# EAGLE design finalizeScale (EAGLE 7.3.0)
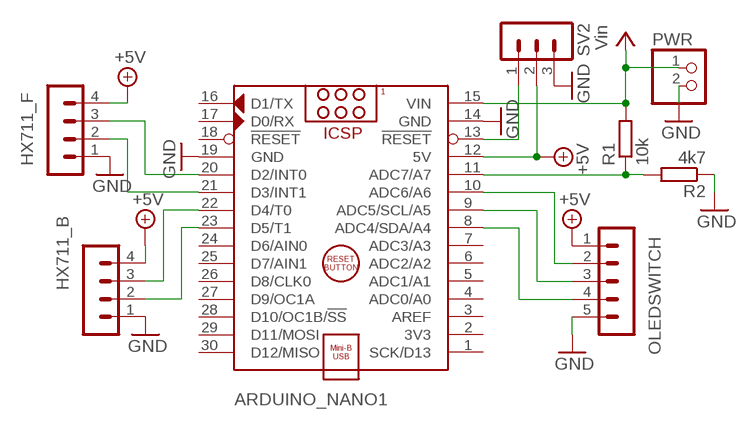
[diagram p0: schematic, sheet 1]

## Parts
ARDUINO_NANO1  ARDUINO_NANO  [ARDUINO_NANO]
HX711_B  MA04-1  [MA04-1]
HX711_F  MA04-1  [MA04-1]
OLEDSWITCH  MA05-1  [MA05-1]
PWR  PINHD-1X2  [1X02]
R1  10k  R-EU_0207/10  [0207/10]
R2  4k7  R-EU_0207/10  [0207/10]
SV2  MA03-1  [MA03-1]

## Nets
+5V: ARDUINO_NANO1.12(5V) HX711_B.4 HX711_F.4 OLEDSWITCH.1 SV2.2
GND: ARDUINO_NANO1.14(GND) ARDUINO_NANO1.19(GND) HX711_B.1 HX711_F.1 OLEDSWITCH.5 PWR.2 R2.1 SV2.3
N$2: ARDUINO_NANO1.8(ADC4/SDA/A4) OLEDSWITCH.4
N$3: ARDUINO_NANO1.9(ADC5/SCL/A5) OLEDSWITCH.3
N$4: ARDUINO_NANO1.11(ADC7/A7) R1.1 R2.2
N$5: ARDUINO_NANO1.21(D3/INT1) HX711_F.2
N$9: ARDUINO_NANO1.10(ADC6/A6) OLEDSWITCH.2
N$10: ARDUINO_NANO1.22(D4/T0) HX711_B.3
N$11: ARDUINO_NANO1.23(D5/T1) HX711_B.2
N$12: ARDUINO_NANO1.20(D2/INT0) HX711_F.3
N$14: ARDUINO_NANO1.13(!RESET) SV2.1
VCC: ARDUINO_NANO1.15(VIN) PWR.1 R1.2 ; supply symbol labelled Vin
Unconnected: ARDUINO_NANO1.1(SCK/D13) ARDUINO_NANO1.2(3V3) ARDUINO_NANO1.3(AREF) ARDUINO_NANO1.4(ADC0/A0) ARDUINO_NANO1.5(ADC1/A1) ARDUINO_NANO1.6(ADC2/A2) ARDUINO_NANO1.7(ADC3/A3) ARDUINO_NANO1.16(D1/TX) ARDUINO_NANO1.17(D0/RX) ARDUINO_NANO1.18(!RESET) ARDUINO_NANO1.24(D6/AIN0) ARDUINO_NANO1.25(D7/AIN1) ARDUINO_NANO1.26(D8/CLK0) ARDUINO_NANO1.27(D9/OC1A) ARDUINO_NANO1.28(D10/OC1B/!SS) ARDUINO_NANO1.29(D11/MOSI) ARDUINO_NANO1.30(D12/MISO)

## Library data of the parts
ARDUINO_NANO1 = ArduinoNanoV30:ARDUINO_NANO: Arduino Nano V3.0 Module Overview: The Arduino Nano is a small, complete, and breadboard-friendly board based on the ATmega328 (Arduino Nano 3.x) or ATmega168 (Arduino Nano 2.x). It has more or less the same functionality of the Arduino Duemilanove, but in a different package. It lacks only a DC power jack, and works with a Mini-B USB cable instead of a standard one. The Nano was designed and is being produced by Gravitech <http://www.gravitech.us/arna30wiatp.html>. General specifications: Item Value Microcontroller Atmel ATmega168 or ATmega328 Operating Voltage (logic level) 5 V Input Voltage (recommended) 7-12 V Input Voltage (limits) 6-20 V Digital I/O Pins 14 (of which 6 provide PWM output) Analog Input Pins 8 DC Current per I/O Pin 40 mA Flash Memory 16 KB (ATmega168) or 32 KB (ATmega328) of which 2 KB used by bootloader SRAM 1 KB (ATmega168) or 2 KB (ATmega328) EEPROM 512 bytes (ATmega168) or 1 KB (ATmega328) Clock Speed 16 MHz Dimensions (Inches) 0.73" x 1.70" Dimensions (mm) 18mm x 45mm Overall height About 9 mm (not including pins) Weigth 5 g Power: The Arduino Nano can be powered via the Mini-B USB connection, 6-20V unregulated external power supply (pin 30), or 5V regulated external power supply (pin 27). The power source is automatically selected to the highest voltage source. Memory: The ATmega168 has 16 KB of flash memory for storing code (of which 2 KB is used for the bootloader); the ATmega328 has 32 KB, (also with 2 KB used for the bootloader). The ATmega168 has 1 KB of SRAM and 512 bytes of EEPROM (which can be read and written with the EEPROM library); the ATmega328 has 2 KB of SRAM and 1 KB of EEPROM. Input and Output: Each of the 14 digital pins on the Nano can be used as an input or output, using pinMode(), digitalWrite(), and digitalRead() functions. They operate at 5 volts. Each pin can provide or receive a maximum of 40 mA and has an internal pull-up resistor (disconnected by default) of 20-50 kOhms. In addition, some pins have specialized functions. Visit Arduino - ArduinoBoardNano <https://www.arduino.cc/en/Main/ArduinoBoardNano>
HX711_B HX711_F = con-lstb:MA04-1: PIN HEADER; OC_FARNELL: unknown; OC_NEWARK: unknown
OLEDSWITCH = con-lstb:MA05-1: PIN HEADER; OC_FARNELL: unknown; OC_NEWARK: unknown
PWR = pinhead:PINHD-1X2: PIN HEADER
R1 R2 = rcl:R-EU_: RESISTOR, European symbol
SV2 = con-lstb:MA03-1: PIN HEADER; OC_FARNELL: unknown; OC_NEWARK: unknown

## Net classes
0 default: width 0.076 mm, drill 0.025 mm, clearance 0.013 mm

## Board
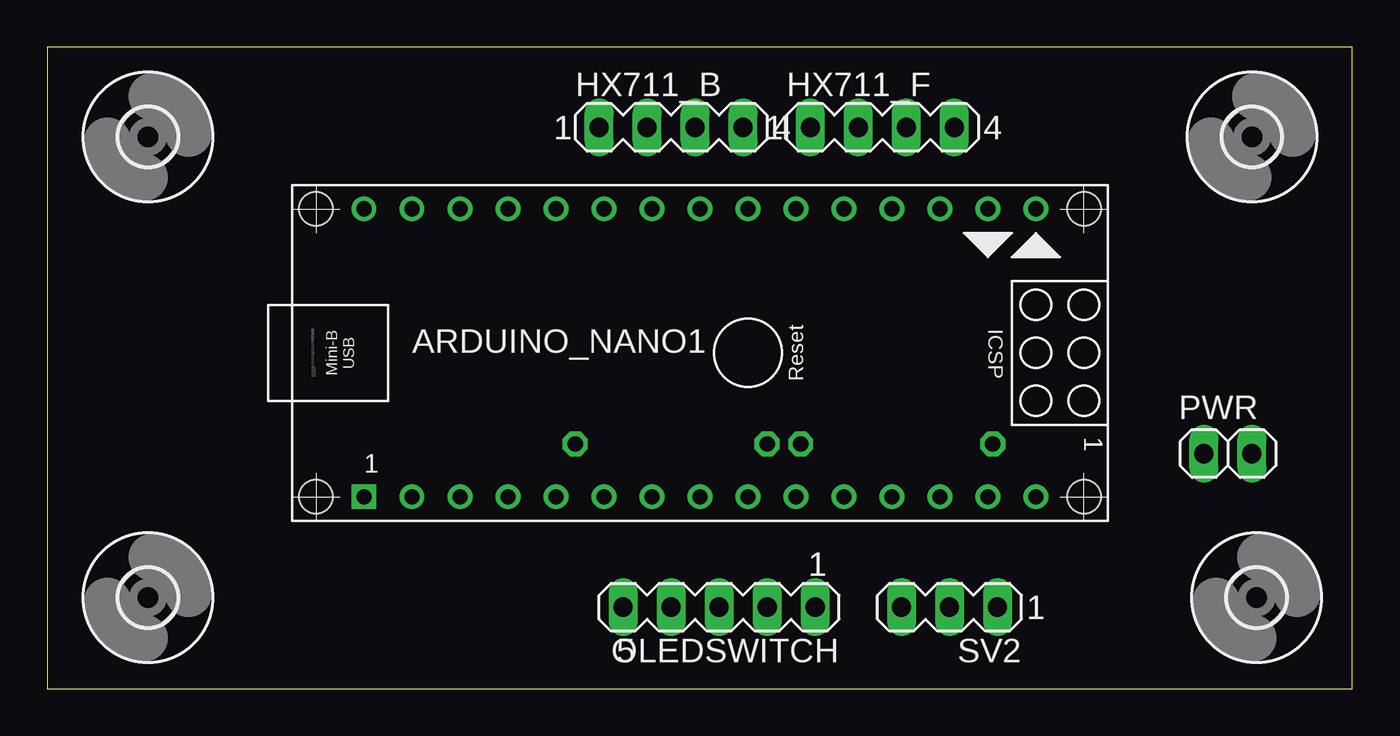
[diagram p1: board, top side]
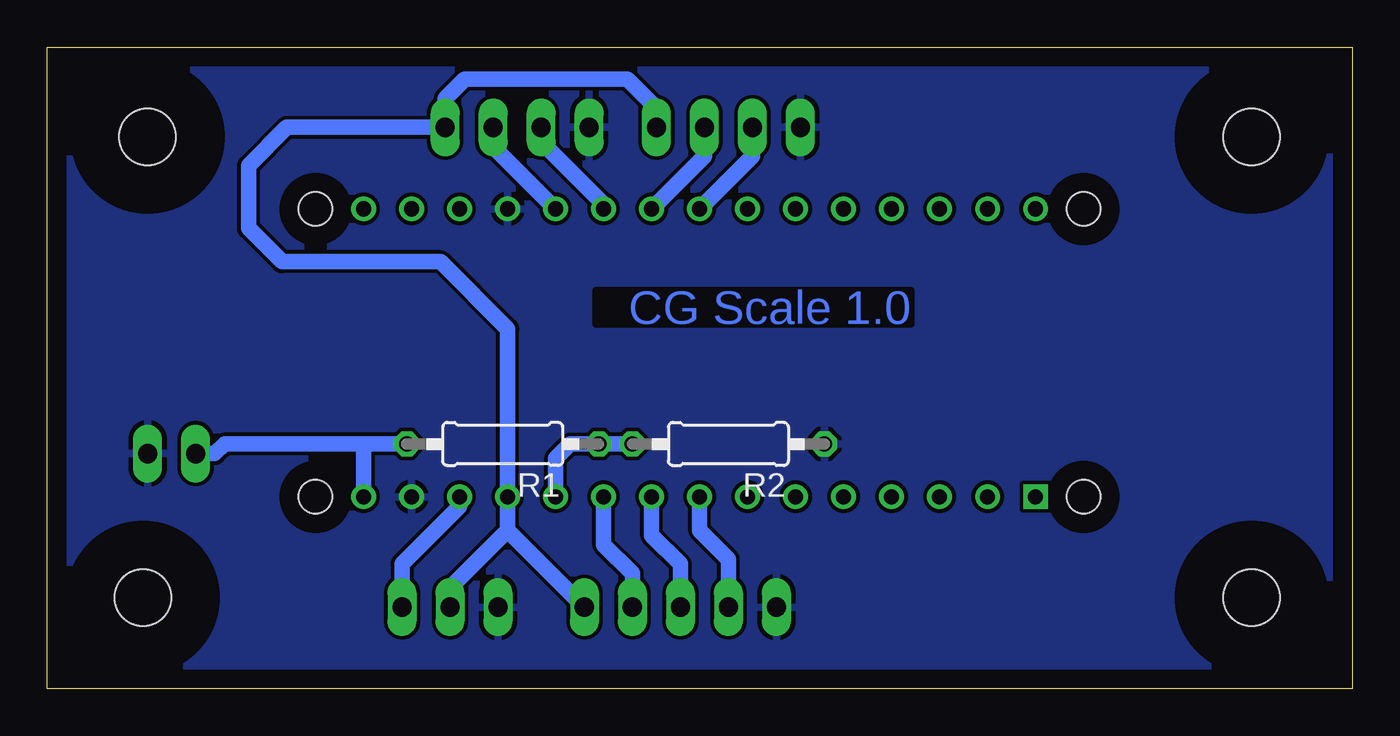
[diagram p2: board, bottom side, seen from below]

Size 69.07 x 33.96 mm. Coordinates in mm from the lower left corner, seen from the top.
Outline: 0,0 69.07,0 69.07,33.96 0,33.96 0,0
Copper layers (1*16): Top 0.035mm / dielectric 1.5mm / Bottom 0.035mm
Design rules "default": minimum track width 10mil, minimum drill 24mil, track to track 8mil, track to pad 8mil, pad to pad 8mil, via to via 8mil, smd to smd 8mil, copper to edge 40mil, drill to drill 8mil, minimum pad ring 10mil, minimum via ring 8mil, stop-mask expansion 4mil, vias tented up to drill 0mil, thermal gap 10mil

### Footprints (pad centres in the part's own frame; a part is rotated, then mirrored left to right if it is on the bottom)
ARDUINO_NANO = drill 0.8 square: 1 -20.32,-7.62 | drill 0.8: 2 -17.78,-7.62; 3 -15.24,-7.62; 4 -12.7,-7.62; 5 -10.16,-7.62; 6 -7.62,-7.62; 7 -5.08,-7.62; 8 -2.54,-7.62; 9 0,-7.62; 10 2.54,-7.62; 11 5.08,-7.62; 12 7.62,-7.62; 13 10.16,-7.62; 14 12.7,-7.62; 15 15.24,-7.62; 16 15.24,7.62; 17 12.7,7.62; 18 10.16,7.62; 19 7.62,7.62; 20 5.08,7.62; 21 2.54,7.62; 22 0,7.62; 23 -2.54,7.62; 24 -5.08,7.62; 25 -7.62,7.62; 26 -10.16,7.62; 27 -12.7,7.62; 28 -15.24,7.62; 29 -17.78,7.62; 30 -20.32,7.62 | hole 1.778: -22.86,-7.62; -22.86,7.62; 17.78,7.62; 17.78,-7.62
MA04-1 = drill 1.016 long: 1 -3.81,0; 2 -1.27,0; 3 1.27,0; 4 3.81,0
MA05-1 = drill 1.016 long: 1 -5.08,0; 2 -2.54,0; 3 0,0; 4 2.54,0; 5 5.08,0
1X02 = drill 1.016 long: 1 -1.27,0; 2 1.27,0
0207/10 = drill 0.813 octagon: 1 -5.08,0; 2 5.08,0
MA03-1 = drill 1.016 long: 1 -2.54,0; 2 0,0; 3 2.54,0
3,0 = hole 3: 0,0

### Placement (x,y rotation side)
ARDUINO_NANO1  37.08,17.78 0 top
HX711_B  33.02,29.72 0 top
HX711_F  44.2,29.72 0 top
OLEDSWITCH  35.56,4.32 180 top
PWR  62.48,12.45 0 top
R1  44.96,12.95 180 bottom
R2  33.02,12.95 180 bottom
SV2  47.75,4.32 180 top
U$1  [3,0]  5.33,29.21 0 top
U$2  [3,0]  5.33,4.83 0 top
U$3  [3,0]  64.01,4.83 0 top
U$4  [3,0]  63.75,29.21 0 top

### Tracks (layer width: path | path; a pad name or v marks a point on that pad's centre or on a via)
+5V
  Bottom 0.813: SV2.2 47.75,5.33 44.7,8.38 | 44.7,8.38 ARDUINO_NANO1.12 44.7,19.05 48.26,22.61 56.64,22.61 58.42,24.38 58.42,27.69 56.39,29.72 HX711_F.4 48.01,31.24 46.99,32.26 38.35,32.26 36.83,30.73 HX711_B.4 | OLEDSWITCH.1 44.7,8.38
GND
  pour Bottom: -4.32,85.09 102.36,84.58 102.36,-2.03 -4.57,-1.78 -3.3,20.57
N$2
  Bottom 0.813: OLEDSWITCH.4 33.02,6.86 34.54,8.38 ARDUINO_NANO1.8
N$3
  Bottom 0.813: OLEDSWITCH.3 35.56,6.6 37.08,8.13 ARDUINO_NANO1.9
N$4
  Bottom 0.813: R2.2 R1.1 41.4,12.95 42.16,12.19 ARDUINO_NANO1.11
N$5
  Bottom 0.813: ARDUINO_NANO1.21 39.62,25.65 42.93,28.96 HX711_F.2
N$9
  Bottom 0.813: OLEDSWITCH.2 38.1,6.1 39.62,7.62 ARDUINO_NANO1.10
N$10
  Bottom 0.813: HX711_B.3 34.29,28.19 ARDUINO_NANO1.22
N$11
  Bottom 0.813: ARDUINO_NANO1.23 31.75,28.19 HX711_B.2
N$12
  Bottom 0.813: ARDUINO_NANO1.20 45.47,28.7 HX711_F.3
N$14
  Bottom 0.813: ARDUINO_NANO1.13 47.24,9.65 50.29,6.6 SV2.1
VCC
  Bottom 0.813: R1.2 52.32,12.95 | 52.32,12.95 59.69,12.95 60.2,12.45 PWR.1 | ARDUINO_NANO1.15 52.32,12.95

### Text on the board
Bottom: CG Scale 1.0